# EAGLE design nonregulation-level-shifter-mk-2.2 (EAGLE 7.5.0)
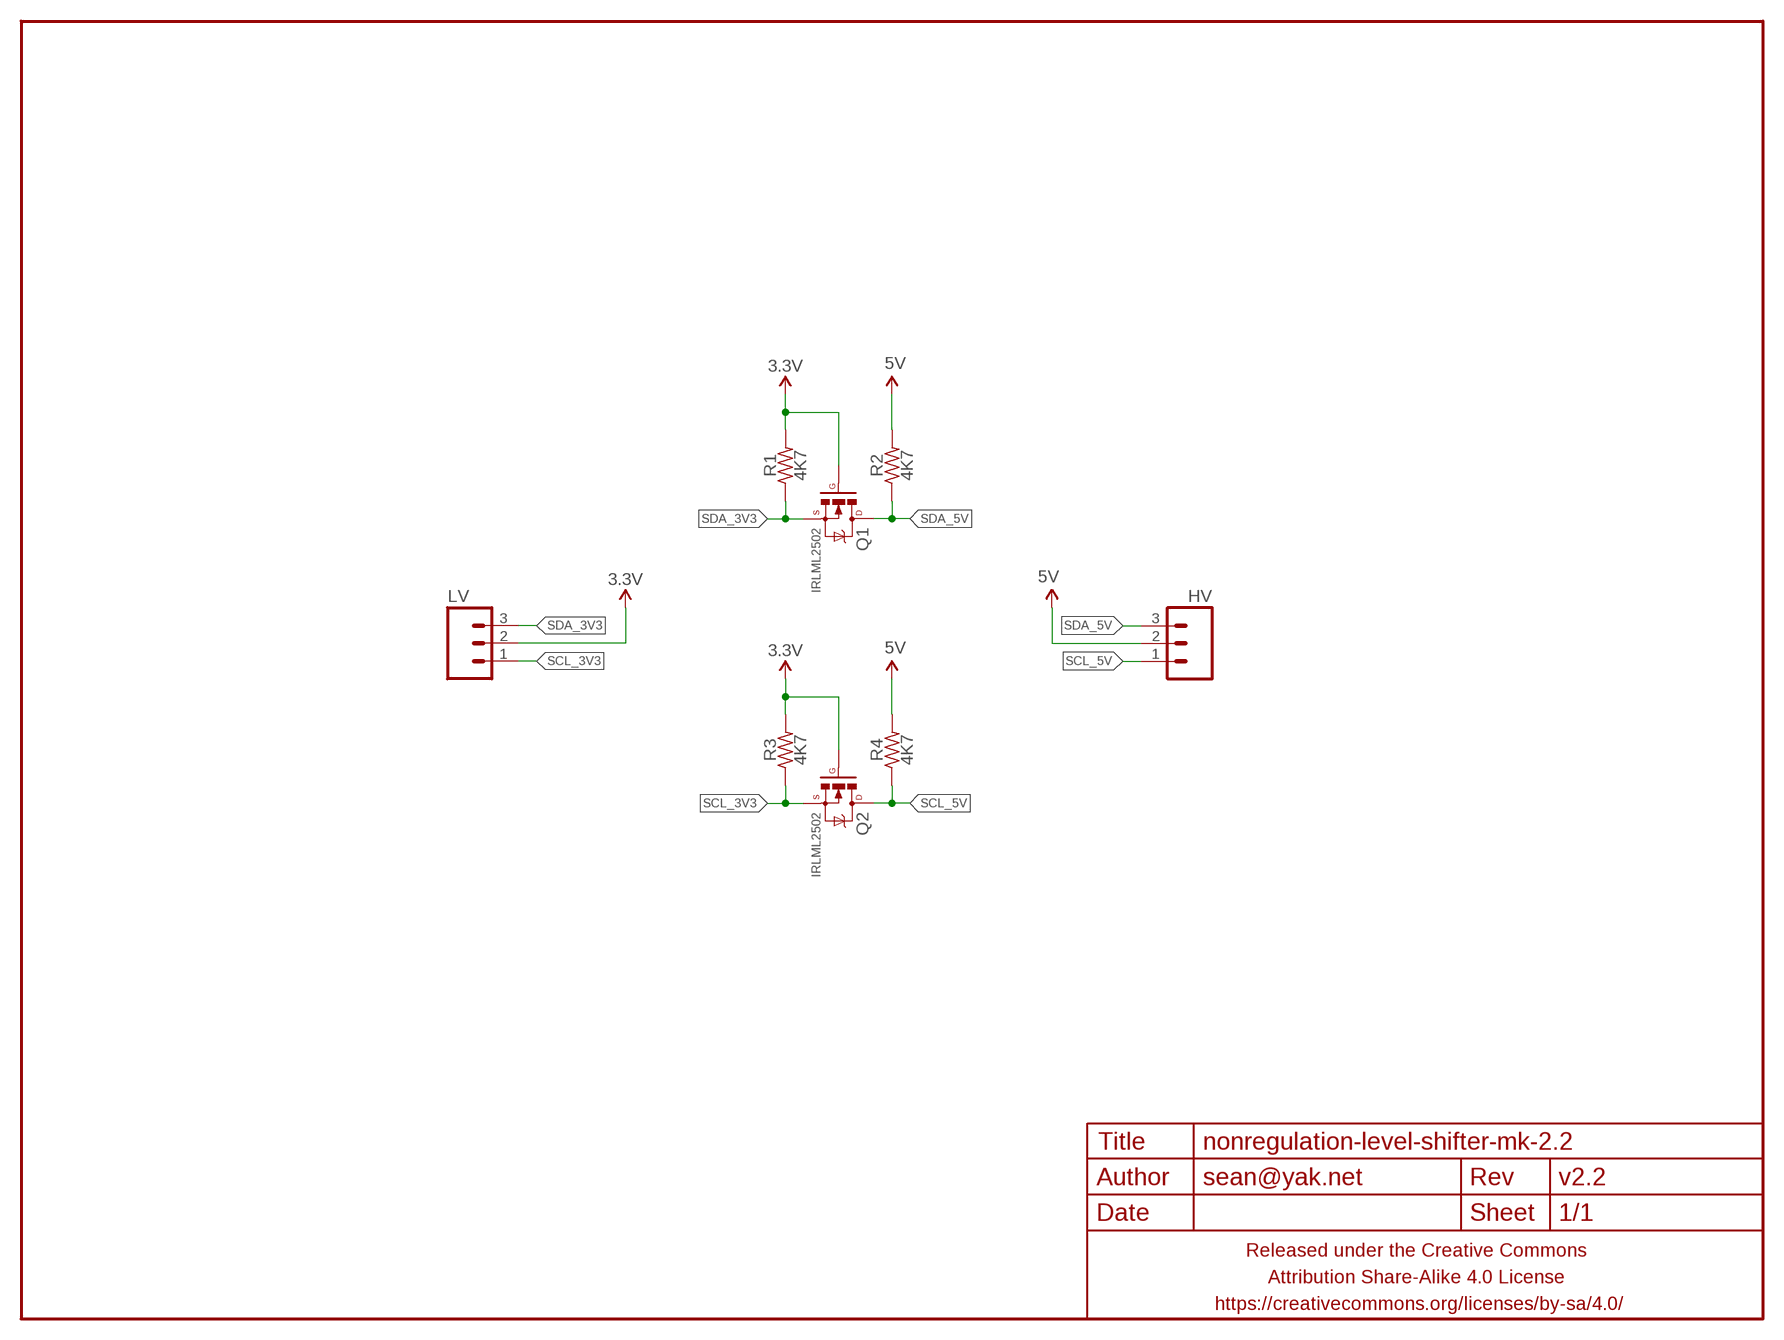
[diagram p0: schematic, sheet 1]

## Parts
FRAME1  FRAME-LETTERNO_PACKAGE  [DUMMY]
HV  M03PTH-CENTERED  [1X03-CENTERED]
LV  M03PTH-CENTERED  [1X03-CENTERED]
Q1  IRLML2502  MOSFET-NCHANNELIRLML2502  [SOT23]
Q2  IRLML2502  MOSFET-NCHANNELIRLML2502  [SOT23]
R1  4K7  RESISTORR0603  [R0603]
R2  4K7  RESISTORR0603  [R0603]
R3  4K7  RESISTORR0603  [R0603]
R4  4K7  RESISTORR0603  [R0603]

## Nets
3.3V: LV.2 Q1.1(G) Q2.1(G) R1.2 R3.2
5V: HV.2 R2.2 R4.2
SCL_3V3: LV.1 Q2.2(S) R3.1
SCL_5V: HV.1 Q2.3(D) R4.1
SDA_3V3: LV.3 Q1.2(S) R1.1
SDA_5V: HV.3 Q1.3(D) R2.1

## Library data of the parts
FRAME1 = A_butts:FRAME-LETTER: Schematic Frame Standard 8.5x11 US Letter frame; DESIGNER: sean@yak.net; VERSION: v2.2
HV LV = a_parts:M03: Header 3 Standard 3-pin 0.1" header. Use with straight break away headers (SKU : PRT-00116), right angle break away headers (PRT-00553), swiss pins (PRT-00743), machine pins (PRT-00117), and female headers (PRT-00115). Molex polarized connector foot print use with SKU : PRT-08232 with associated crimp pins and housings.
Q1 Q2 = a_parts:MOSFET-NCHANNEL: Common NMOSFET Parts MFG P/N Store ID Prod ID FDD8780 TRANS-09984 SI7820DN TRANS-11055 FDS6630A IC-08089 2N7002PW TRANS-11151 FQP30N06L COM-10213 TRANS-10060 BSS123LT1G TRANS-08345 BSS138 TRANS-00830 BS170 2N7000
R1-R4 = a_parts:RESISTOR: RESISTOR, American symbol

## Board
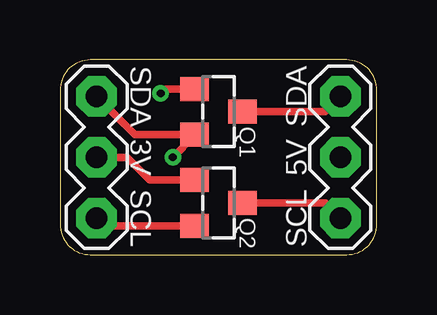
[diagram p1: board, top side]
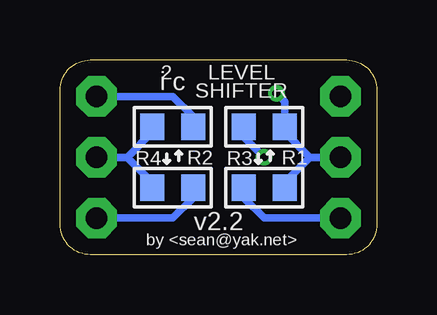
[diagram p2: board, bottom side, seen from below]

Size 13.21 x 8.13 mm. Coordinates in mm from the lower left corner, seen from the top.
Outline: 0,6.86 0,1.27 arc90 1.27,0 11.94,0 arc90 13.21,1.27 13.21,6.86 arc90 11.94,8.13 1.27,8.13 arc90 0,6.86
Copper layers (1*16): Top 0.0356mm / dielectric 1.5011mm / Bottom 0.0356mm
Design rules "LaenPCBOrder_2": minimum track width 6mil, minimum drill 13mil, track to track 6mil, track to pad 6mil, pad to pad 6mil, via to via 6mil, smd to smd 6mil, copper to edge 15mil, drill to drill 6mil, minimum pad ring 7mil, minimum via ring 7mil, stop-mask expansion 3mil, vias tented up to drill 20mil, thermal gap 10mil

### Footprints (pad centres in the part's own frame; a part is rotated, then mirrored left to right if it is on the bottom)
1X03-CENTERED = drill 0.9 pad 1.7 octagon: 1 -2.54,0; 2 0,0; 3 2.54,0
SOT23 = smd 1 x 1.2: 1 -0.95,-1; 2 0.95,-1; 3 0,1
R0603 = smd 1 x 1.1: 1 -0.85,0; 2 0.85,0

### Placement (x,y rotation side)
FRAME1  0.25,0.25 0 top
HV  11.68,4.06 90 top
LV  1.52,4.06 90 top
Q1  6.6,5.97 270 top
Q2  6.6,2.16 270 top
R1  4.7,5.33 0 bottom
R2  8.51,5.33 180 bottom
R3  4.7,2.79 0 bottom
R4  8.51,2.79 180 bottom

### Tracks (layer width: path | path; a pad name or v marks a point on that pad's centre or on a via)
3.3V  (via drill 0.33)
  Top 0.305: v4.19,6.73 4.38,6.92 Q1.1 | Q2.1 3.75,3.11 2.79,4.06 LV.2
  Bottom 0.305: R3.2 3.85,3.01 2.79,4.06 | 2.79,4.06 3.85,5.12 R1.2 3.85,6.39 v4.19,6.73 | 2.79,4.06 LV.2
5V
  Bottom 0.305: HV.2 10.41,4.06 | R2.2 9.36,5.12 10.41,4.06 | R4.2 9.36,3.01 10.41,4.06
SCL_3V3
  Top 0.305: Q2.2 1.84,1.21 LV.1
  Bottom 0.305: R3.1 5.55,2.37 4.7,1.52 LV.1
SCL_5V
  Top 0.305: Q2.3 11.05,2.16 HV.1
  Bottom 0.305: R4.1 7.66,2.37 8.51,1.52 HV.1
SDA_3V3  (via drill 0.33)
  Top 0.305: v4.7,4.06 5.6,4.97 Q1.2 3.11,5.02 LV.3
  Bottom 0.305: R1.1 5.55,4.91 v4.7,4.06
SDA_5V
  Top 0.305: Q1.3 11.05,5.97 HV.3
  Bottom 0.305: R2.1 7.66,5.75 8.51,6.6 HV.3

### Text on the board
tPlace: SDA | SDA | 3V | 5V | SCL | SCL
bPlace: LEVEL | SHIFTER | i c | 2 | by <sean@yak.net>